# EasyEDA Pro project ProDoc_F407_2_2025-06-26.epro

# Schematic Schematic1_2
Create Date: 2025-05-06; Page Name: P1; Project Name: 主控板; Schematic Name: Schematic1_2; Update Date: 2025-05-06; Company: 嘉立创EDA; Page Size: A4; Version: V1.0
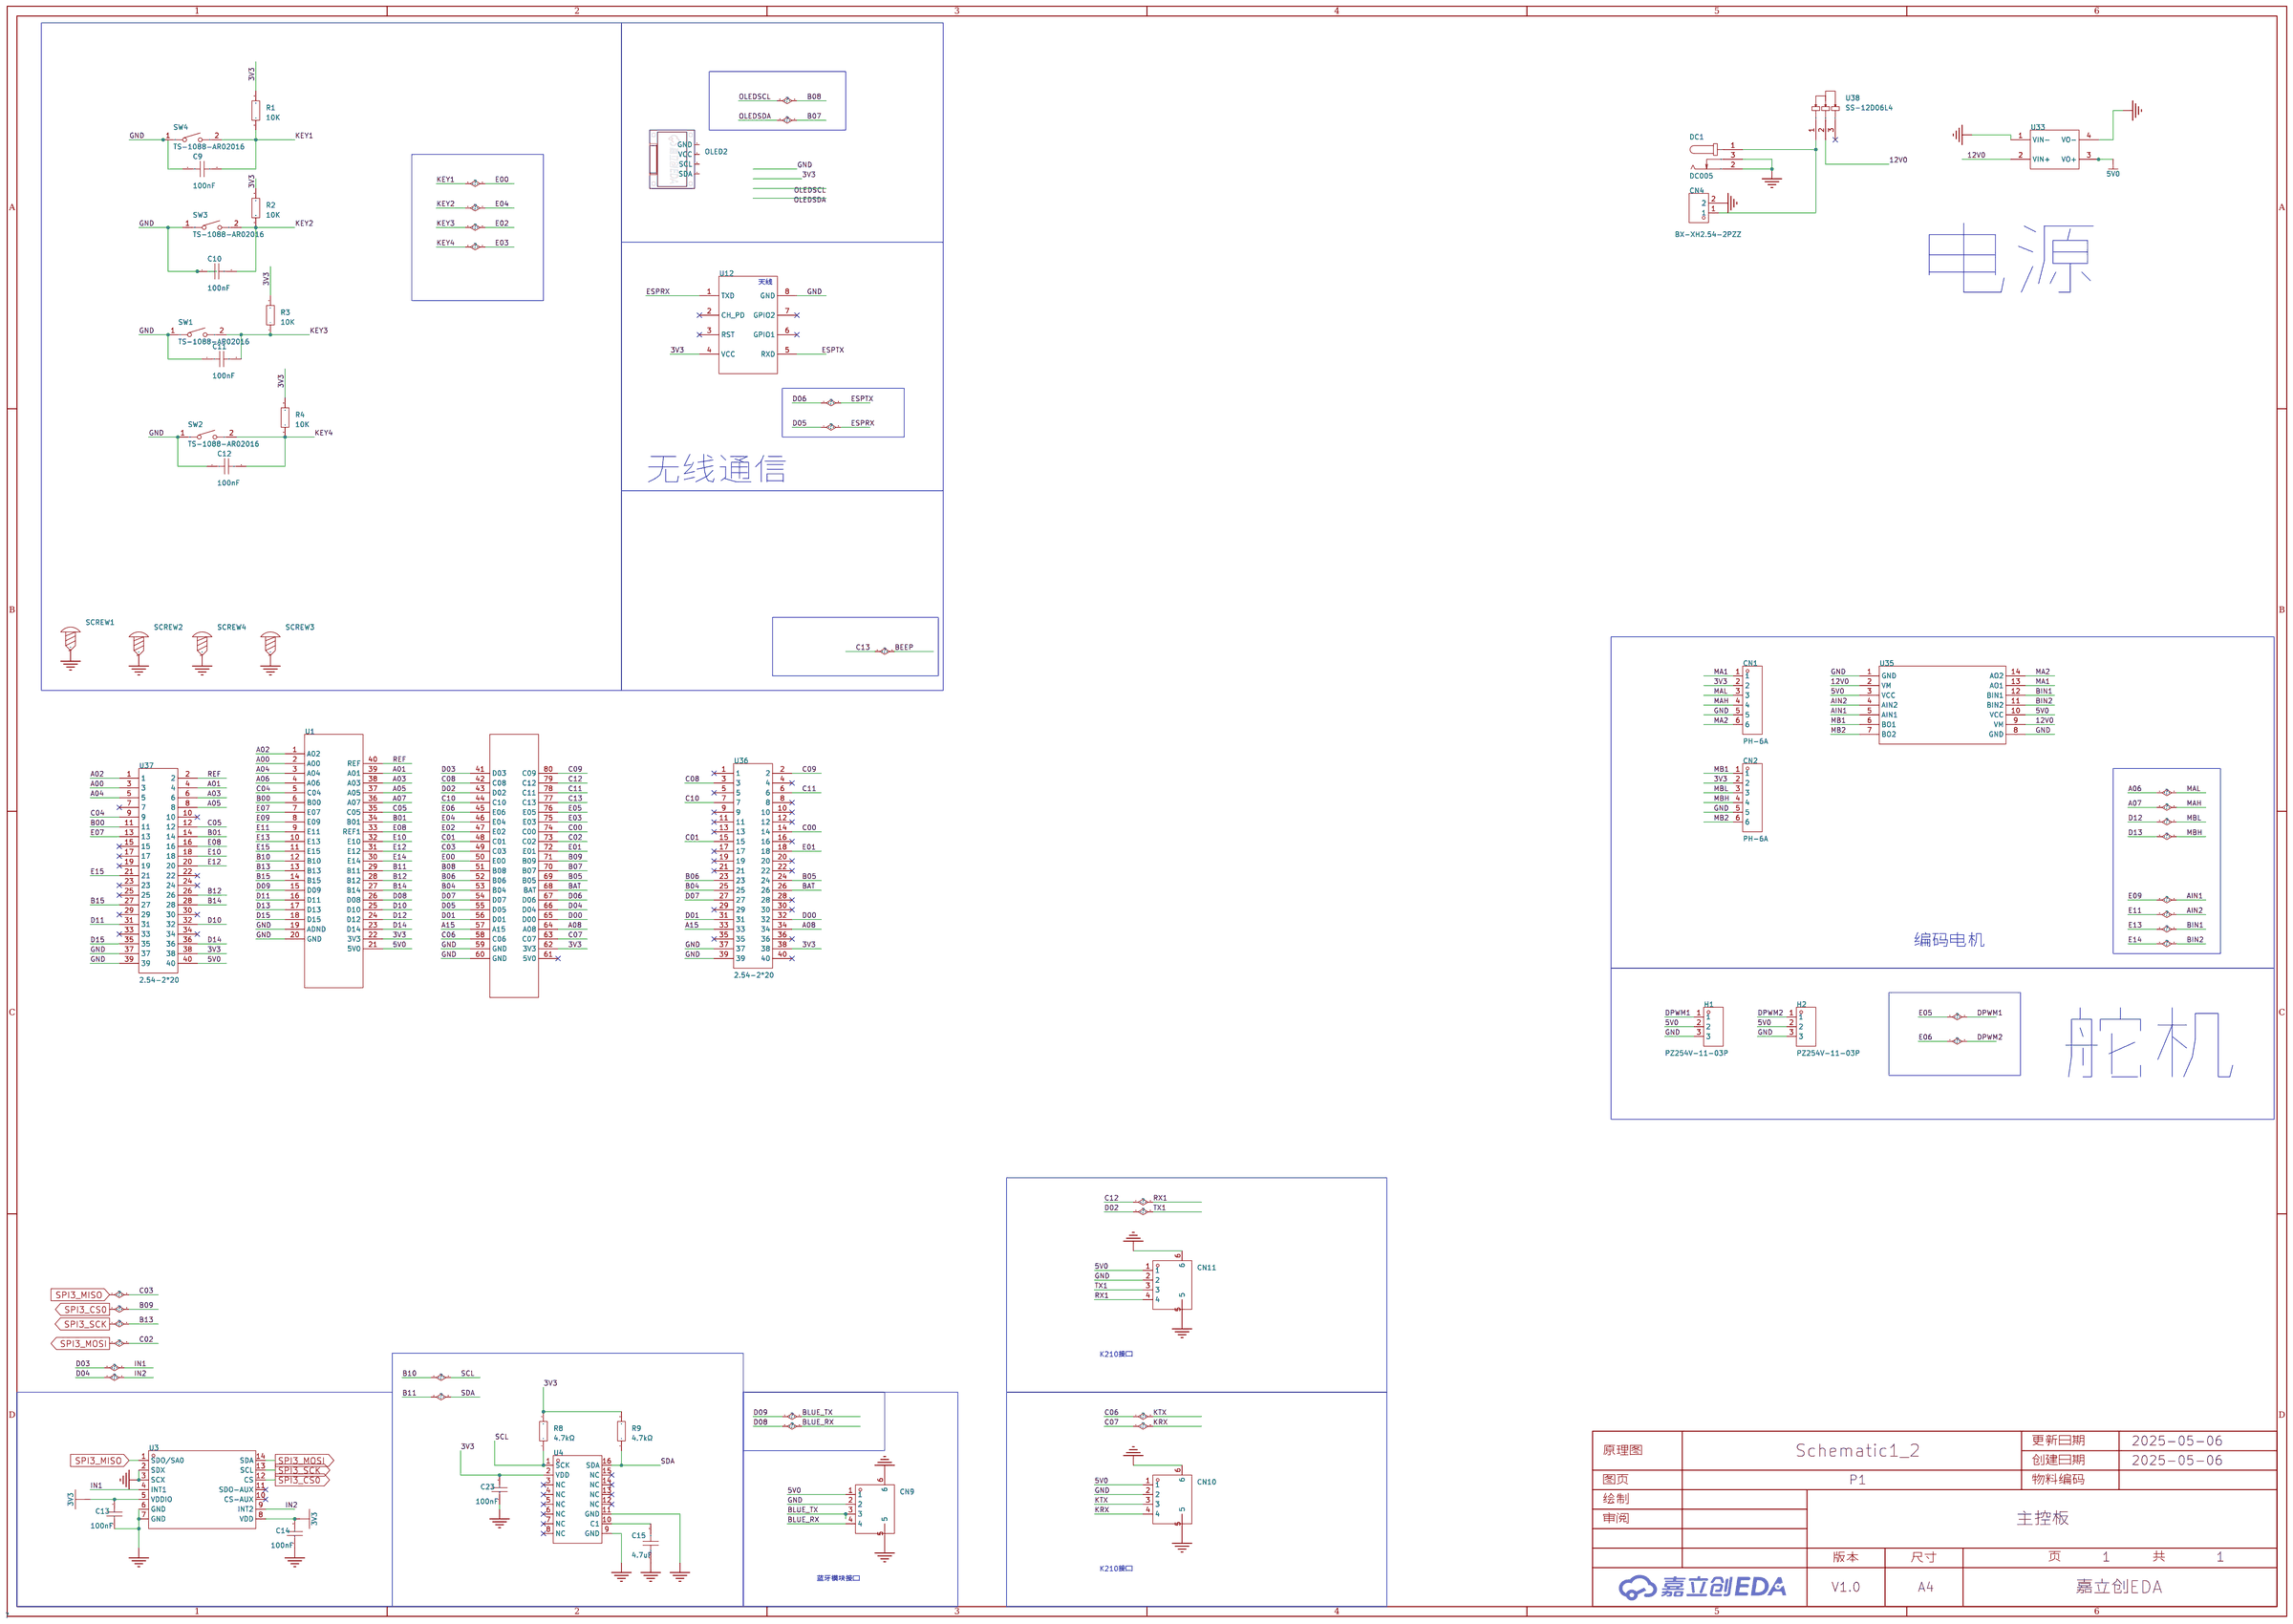
[diagram p0: schematic sheet]

## Parts
C9  100nF  [C0603]
C10  100nF  [C0603]
C11  100nF  [C0603]
C12  100nF  [C0603]
C13  100nF  [C0402]
C14  100nF  [C0402]
C15  4.7uF  [C0402]
C23  100nF  [C0402]
CN1  PH-6A  [CONN-TH_6P-P2.00_PH-6A_C2908627]
CN2  PH-6A  [CONN-TH_6P-P2.00_PH-6A_C2908627]
CN4  BX-XH2.54-2PZZ  [CONN-TH_2P-P2.50_BX-XH2.54-2PZZ]
CN9  A1257WR-S-4P  [CONN-SMD_A1257WR-S-4P]
CN10  A1257WR-S-4P  [CONN-SMD_A1257WR-S-4P]
CN11  A1257WR-S-4P  [CONN-SMD_A1257WR-S-4P]
DC1  DC005  [DC-IN-TH_DC005]
H1  PZ254V-11-03P  [HDR-TH_3P-P2.54-V-M]
H2  PZ254V-11-03P  [HDR-TH_3P-P2.54-V-M]
OLED2  -  [0.96OLED_4P]
R1  10K  [R0603]
R2  10K  [R0603]
R3  10K  [R0603]
R4  10K  [R0603]
R8  4.7kΩ  [R0402]
R9  4.7kΩ  [R0402]
SCREW1  -  [M3螺丝]
SCREW2  -  [M3螺丝]
SCREW3  -  [M3螺丝]
SCREW4  -  [M3螺丝]
SW1  TS-1088-AR02016  [SW-SMD_L3.9-W3.0-P4.45]
SW2  TS-1088-AR02016  [SW-SMD_L3.9-W3.0-P4.45]
SW3  TS-1088-AR02016  [SW-SMD_L3.9-W3.0-P4.45]
SW4  TS-1088-AR02016  [SW-SMD_L3.9-W3.0-P4.45]
U1  -  [f407]
U3  QMI8658A  [LGA-14_L3.0-W2.5-P0.50-TL]
U4  QMC5883P  [LGA-16_L3.0-W3.0-P0.50-BL_SQ]
U12  -  [ESP32-01S]
U33  -  [电源模块]
U35  -  [a4950]
U36  2.54-2*20  [HDR-TH_40P-P2.54-V-F-R2-C20-S2.54]
U37  2.54-2*20  [HDR-TH_40P-P2.54-V-F-R2-C20-S2.54]
U38  SS-12D06L4  [SW-TH_SS-12D06L4]

## Library data of the parts
C9-C12 = CAP_0603: Supplier Footprint: 0603
C13 C14 C23 = CC0402KRX7R9BB104: 容值:100nF;精度:±10%;额定电压:50V;材质(温度系数):X7R;; LCSC Part Name: 100nF ±10% 50V; Supplier Part: C131394; Manufacturer: YAGEO(国巨); Supplier Footprint: 0402; JLCPCB Part Class: Extended Part; Datasheet: https://atta.szlcsc.com/upload/public/pdf/source/20170925/C131394_1506321459057990237.pdf; Supplier: LCSC; Tolerance: ±10%; Voltage Rated: 50V; Temperature Coefficient: X7R
C15 = CC0402KRX5R6BB475: 容值:4.7uF;精度:±10%;额定电压:10V;材质(温度系数):X5R;; LCSC Part Name: 4.7uF ±10% 10V; Supplier Part: C326586; Manufacturer: YAGEO(国巨); Supplier Footprint: 0402; JLCPCB Part Class: Extended Part; Datasheet: https://atta.szlcsc.com/upload/public/pdf/source/20181031/C326586_0A24D5FB832C927D854568E36BF9A1E3.pdf; Supplier: LCSC; Tolerance: ±10%; Voltage Rated: 10V; Temperature Coefficient: X5R
CN1 CN2 = PH-6A_C2908627: 插针结构:1x6P;间距:2mm;安装方式:直插;参考系列:PH;总PIN数:6P;排数:1;每排PIN数:6;行距:-;额定电流:2A;触头材质:黄铜;触头镀层:锡;工作温度范围:-25℃~+85℃;; LCSC Part Name: 1x6P 间距:2mm 直插 系列:PH; Supplier Part: C2908627; Manufacturer: HCTL(华灿天禄); Supplier Footprint: 插件,P=2mm; JLCPCB Part Class: 扩展库; Datasheet: https://atta.szlcsc.com/upload/public/pdf/source/20230707/BA576CECAD32FECA9ECBAF2430E681CE.pdf; Supplier: LCSC; Pins Structure: 1x6P; Pitch: 2mm; Mounting Style: 直插; Reference Series: PH; Number of Pins: 6P; Number of Rows: 1; Number of PINs Per Row: 6; Current Rating (Max): 2A; Contact Material: 黄铜; Contact Plating: 锡; Operating Temperature Range: -25℃~+85℃
CN4 = BX-XH2.54-2PZZ: 插针结构:1x2P;间距:2.54mm;安装方式:直插;参考系列:XH;总PIN数:2P;排数:1;每排PIN数:2;行距:-;额定电流:3A;触头材质:黄铜;触头镀层:锡;工作温度范围:-25℃~+85℃;; LCSC Part Name: 配套胶壳型号：BX-XH2.54-2PJK 配套端子型号：BX-XH2.54-DZ 配套杜邦线型号：BX-XH2.54-2PBXC; Supplier Part: C18077833; Manufacturer: Bossie(博锡); Supplier Footprint: 插件,P=2.54mm; JLCPCB Part Class: 扩展库; Datasheet: https://atta.szlcsc.com/upload/public/pdf/source/20231017/CB25E46A13930659CD6CDE2F2553A508.pdf; Supplier: LCSC; Pins Structure: 1x2P; Pitch: 2.54mm; Mounting Style: 直插; Reference Series: XH; Number of Pins: 2P; Number of Rows: 1; Number of PINs Per Row: 2; Current Rating (Max): 3A; Contact Material: 黄铜; Contact Plating: 锡; Operating Temperature Range: -25℃~+85℃
CN9-CN11 = A1257WR-S-4P: 参考系列:GH;间距:1.25mm;插针结构:1x4P;排数:1;每排PIN数:4;行距:-;安装方式:-;触头材质:黄铜;; LCSC Part Name: GH1.25卧式贴片 镀锡 4P 针座连接器; Supplier Part: C225127; Manufacturer: CJT(长江连接器); Supplier Footprint: SMD,P=1.25mm; JLCPCB Part Class: 扩展库; Datasheet: https://atta.szlcsc.com/upload/public/pdf/source/20180509/C225127_D8D3C7F8F1F45F960D198B1E232900BE.pdf; Supplier: LCSC; Reference Series: GH; Pitch: 1.25mm; Pins Structure: 1x4P; Number of Rows: 1; Number of PINs Per Row: 4; Contact Material: 黄铜
DC1 = DC005: 连接器类型:DC电源插座;安装方式:弯插;触点内径:2mm;触点外径:6.3mm;额定电流:500mA;额定电压:30V;工作温度范围:-40℃~+55℃;; LCSC Part Name: DC电源插座 内径:2mm 外径:6.3mm; Supplier Part: C431533; Manufacturer: SHOU HAN(首韩); Supplier Footprint: 插件; JLCPCB Part Class: 扩展库; Datasheet: https://atta.szlcsc.com/upload/public/pdf/source/20190925/C431533_4751811035784AC1D38EBC85F7905E99.pdf; Supplier: LCSC; Connector Type: DC电源插座; Mounting Style: 弯插; Inside Contact Diameter: 2mm; Outside Contact Diameter: 6.3mm; Current Rating (Max): 500mA; Voltage Rating (Max): 30V; Operating Temperature Range: -40℃~+55℃
H1 H2 = PZ254V-11-03P: 插针结构:1x3P;间距:2.54mm;行距:-;圆针/方针:方针;安装类型:直插;排数:单排;总PIN位数:3P;额定电流:3A;额定电压:250V;配合针长度:6mm;塑高:2.5mm;端接针长度:3mm;工作温度范围:-40℃~+105℃;颜色:黑色;; LCSC Part Name: 间距:2.54mm 1x3P 直插 方针; Supplier Part: C2937625; Manufacturer: XFCN(兴飞); Supplier Footprint: 插件,P=2.54mm; JLCPCB Part Class: 扩展库; Datasheet: https://atta.szlcsc.com/upload/public/pdf/source/20200309/C492402_8335C3D49C4E4C618838D59BB1D024C1.pdf; Supplier: LCSC; Pin Structure: 1x3P; Pitch: 2.54mm; Circluar Pins/Square Pins: 方针; Mounting Type: 直插; Number of Rows: 单排; Number of Pins: 3P; Current Rating (Max): 3A; Voltage Rating (Max): 250V; Length of Mating Pin: 6mm; Insulation Height: 2.5mm; Length of End Connection Pin: 3mm; Operating Temperature Range: -40℃~+105℃; Color: 黑色
OLED2 = 0.96OLED模块_4P: Supplier Footprint: 插件
R1-R4 = Res_0603: Supplier Footprint: 0603
R8 R9 = 0402WGF4701TCE: 功率:1/16W;精度:±1%;阻值:4.7kΩ;温度系数:±100ppm/℃;最大工作电压:50V;工作温度范围:-55℃~+155℃;; LCSC Part Name: 4.7KΩ ±1%; Supplier Part: C25900; Manufacturer: UNI-ROYAL(厚声); Supplier Footprint: 0402; JLCPCB Part Class: Basic Part; Datasheet: https://atta.szlcsc.com/upload/public/pdf/source/20170920/C25900_1505895105102980906.pdf; Supplier: LCSC; Power(Watts): 1/16W; Tolerance: ±1%; Temperature Coefficient: ±100ppm/℃; Overload Voltage (Max): 50V; Operating Temperature Range: -55℃~+155℃
SCREW1-SCREW4 = M3螺丝: Supplier Footprint: 插件
SW1-SW4 = TS-1088-AR02016: 电路结构:单刀单掷;按钮形状:圆形按钮;作用力:160gf;安装方式:立贴;开关长度:4mm;开关宽度:3mm;开关高度:2mm;带支架:不带;触点电流:50mA;额定电压(DC):12V;绝缘电阻:100MΩ;机械寿命:10万次;; LCSC Part Name: 4*3*2mm 立贴 轻触开关; Supplier Part: C720477; Manufacturer: XUNPU(讯普); Supplier Footprint: SMD; JLCPCB Part Class: 扩展库; Datasheet: https://atta.szlcsc.com/upload/public/pdf/source/20200810/C720475_60D09DD6C54279ADDB2DC25100F1CC11.pdf; Supplier: LCSC; Circuit: 单刀单掷; Actuator Style: 圆形按钮; Operating Force: 160gf; Mounting Style: 立贴; Switch Length: 4mm; Switch Width: 3mm; Switch Height: 2mm; Strike Gundam: 不带; Contact Current: 50mA; Voltage Rating (DC): 12V; Insulation Resistance: 100MΩ; Actuator/Cap Color: 黑色; Pin Style: SMD接片; Mechanical Life: 10万次; Operating Temperature: -30℃~+80℃
U1 = f407
U3 = QMI8658A_C3021082: LCSC Part Name: 六轴陀螺仪; Supplier Part: C3021082; Manufacturer: QST(上海矽睿); Supplier Footprint: LGA-14; JLCPCB Part Class: Extended Part; Datasheet: https://atta.szlcsc.com/upload/public/pdf/source/20220606/4530BB6F29A519BF0DD0138DD1171FAE.pdf; Supplier: LCSC
U4 = QMC5883P: LCSC Part Name: 三轴磁传感器; Supplier Part: C2847467; Manufacturer: QST(上海矽睿); Supplier Footprint: LGA-16(3x3); JLCPCB Part Class: Extended Part; Datasheet: https://atta.szlcsc.com/upload/public/pdf/source/20210716/C2847467_A90ABEF37B1EC59AF528AF03CB0C7271.pdf; Supplier: LCSC
U12 = ESP32-01S
U33 = 电源模块
U35 = a4950
U36 U37 = 2.54-2*20: 插孔结构:2x20P;间距:2.54mm;行距:2.54mm;圆孔/方孔:方孔;安装类型:直插;排数:双排;总孔位数:40P;额定电流:2.5A;额定电压:-;插孔方向:顶部;塑高:8.5mm;工作温度范围:-40℃~+105℃;; LCSC Part Name: 间距:2.54mm 2x20P 直插; Supplier Part: C2977589; Manufacturer: ZHOURI(洲日); Supplier Footprint: 插件,P=2.54mm; JLCPCB Part Class: 扩展库; Datasheet: https://atta.szlcsc.com/upload/public/pdf/source/20220328/834E302BE3C038BBC5C70F5E02589B1E.pdf; Supplier: LCSC; Holes Structure: 2x20P; Pitch: 2.54mm; Row Spacing: 2.54mm; Circular Hole / Square Hole: 方孔; Mounting Type: 直插; Number of Rows: 双排; Number of Holes: 40P; Current Rating (Max): 2.5A; Holes Direction: 顶部; Insulation Height: 8.5mm; Operating Temperature Range: -40℃~+105℃
U38 = SS-12D06L4: 开关颜色:黑色;; Supplier Part: C2999734; Manufacturer: XKB Connection(中国星坤); Supplier Footprint: 插件; JLCPCB Part Class: 扩展库; Datasheet: https://atta.szlcsc.com/upload/public/pdf/source/20211009/0D67854FD60FB1F6FE75130AD47C052C.pdf; Supplier: LCSC; Actuator Color: 黑色

## Nets
3V3: C13.2 C14.2 C23.2 CN1.2 CN2.2 R1.2 R2.2 R3.2 R4.2 R8.2 R9.2 U1.22(3V3) U1.62(3V3) U3.5(VDDIO) U3.8(VDD) U4.2(VDD) U12.4(VCC) U36.38 U37.38
5V0: CN9.1 CN10.1 CN11.1 H1.2 H2.2 U1.21(5V0) U33.3(VO+) U35.3(VCC) U35.10(VCC) U37.40
12V0: U33.2(VIN+) U35.2(VM) U35.9(VM) U38.2
GND: C9.1 C10.1 C11.1 C12.1 C13.1 C14.1 C15.1 C23.1 CN1.5 CN2.5 CN4.2 CN9.2 CN9.5 CN9.6 CN10.2 CN10.5 CN10.6 CN11.2 CN11.5 CN11.6 DC1.2 DC1.3 H1.3 H2.3 SCREW1.1 SCREW2.1 SCREW3.1 SCREW4.1 SW1.1 SW2.1 SW3.1 SW4.1 U1.19(ADND) U1.20(GND) U1.59(GND) U1.60(GND) U3.2(SDX) U3.3(SCX) U3.6(GND) U3.7(GND) U4.9(GND) U4.11(GND) U12.8(GND) U33.1(VIN-) U33.4(VO-) U35.1(GND) U35.8(GND) U36.37 U36.39 U37.37 U37.39
A00: U1.2(A00) U37.3
A01: U1.39(A01) U37.4
A02: U1.1(A02) U37.1
A03: U1.38(A03) U37.6
A04: U1.3(A04) U37.5
A05: U1.37(A05) U37.8
A06: CN1.3 U1.4(A06)
A07: CN1.4 U1.36(A07)
A08: U1.64(A08) U36.34
A15: U1.57(A15) U36.33
AIN1: U1.8(E09) U35.5(AIN1)
AIN2: U1.9(E11) U35.4(AIN2)
B00: U1.6(B00) U37.11
B01: U1.34(B01) U37.14
B04: U1.53(B04) U36.25
B05: U1.69(B05) U36.24
B06: U1.52(B06) U36.23
B07: U1.70(B07)
B08: U1.51(B08)
B09: U1.71(B09) U3.12(CS)
B10: R8.1 U1.12(B10) U4.1(SCK)
B11: R9.1 U1.29(B11) U4.16(SDA)
B12: U1.28(B12) U37.26
B13: U1.13(B13) U3.13(SCL)
B14: U1.27(B14) U37.28
B15: U1.14(B15) U37.27
BAT: U1.68(BAT) U36.26
BEEP: U1.77(C13)
BIN1: U1.10(E13) U35.12(BIN1)
BIN2: U1.30(E14) U35.11(BIN2)
BLUE_RX: CN9.4 U1.26(D08)
BLUE_TX: CN9.3 U1.15(D09)
C00: U1.74(C00) U36.14
C01: U1.48(C01) U36.15
C02: U1.73(C02) U3.14(SDA)
C03: U1.49(C03) U3.1(SDO/SA0)
C04: U1.5(C04) U37.9
C05: U1.35(C05) U37.12
C06: CN10.3 U1.58(C06)
C07: CN10.4 U1.63(C07)
C08: U1.42(C08) U36.3
C09: U1.80(C09) U36.2
C10: U1.44(C10) U36.7
C11: U1.78(C11) U36.6
C12: CN11.4 U1.79(C12)
D00: U1.65(D00) U36.32
D01: U1.56(D01) U36.31
D02: CN11.3 U1.43(D02)
D03: U1.41(D03) U3.4(INT1)
D04: U1.66(D04) U3.9(INT2)
D05: U1.55(D05) U12.1(TXD)
D06: U1.67(D06) U12.5(RXD)
D07: U1.54(D07) U36.27
D10: U1.25(D10) U37.32
D11: U1.16(D11) U37.31
D12: CN2.3 U1.24(D12)
D13: CN2.4 U1.17(D13)
D14: U1.23(D14) U37.36
D15: U1.18(D15) U37.35
DPWM1: H1.1 U1.76(E05)
DPWM2: H2.1 U1.45(E06)
E00: C9.2 R1.1 SW4.2 U1.50(E00)
E01: U1.72(E01) U36.18
E02: C11.2 R3.1 SW1.2 U1.47(E02)
E03: C12.2 R4.1 SW2.2 U1.75(E03)
E04: C10.2 R2.1 SW3.2 U1.46(E04)
E07: U1.7(E07) U37.13
E08: U1.33(REF1) U37.16
E10: U1.32(E10) U37.18
E12: U1.31(E12) U37.20
E15: U1.11(E15) U37.21
MA1: CN1.1 U35.13(AO1)
MA2: CN1.6 U35.14(AO2)
MB1: CN2.1 U35.6(BO1)
MB2: CN2.6 U35.7(BO2)
REF: U1.40(REF) U37.2
$1N3134: CN4.1 DC1.1 U38.1
$1N18467: C15.2 U4.10(C1)

Not connected (* = marked no-connect by the designer): OLED2 1(GND) 2(VCC) 3(SCL) 4(SDA); U1 61(5V0)*; U3 10(CS-AUX)* 11(SDO-AUX)*; U4 3(NC)* 4(NC)* 5(NC)* 6(NC)* 7(NC)* 8(NC)* 12(NC)* 13(NC)* 14(NC)* 15(NC)*; U12 2(CH_PD)* 3(RST)* 6(GPIO1)* 7(GPIO2)*; U36 1* 4* 5* 8* 9* 10* 11* 12* 13* 16* 17* 19* 20* 21* 22* 28* 29* 30* 35* 36* 40*; U37 7* 10* 15* 17* 19* 22* 23* 24* 25* 29* 30* 33* 34*; U38 3*

## Notes on the sheet
- 天线
- 电源
- 无线通信
- 编码电机
- 舵机
- K210接口
- K210接口
- 蓝牙模块接口

# Board PCB1_2
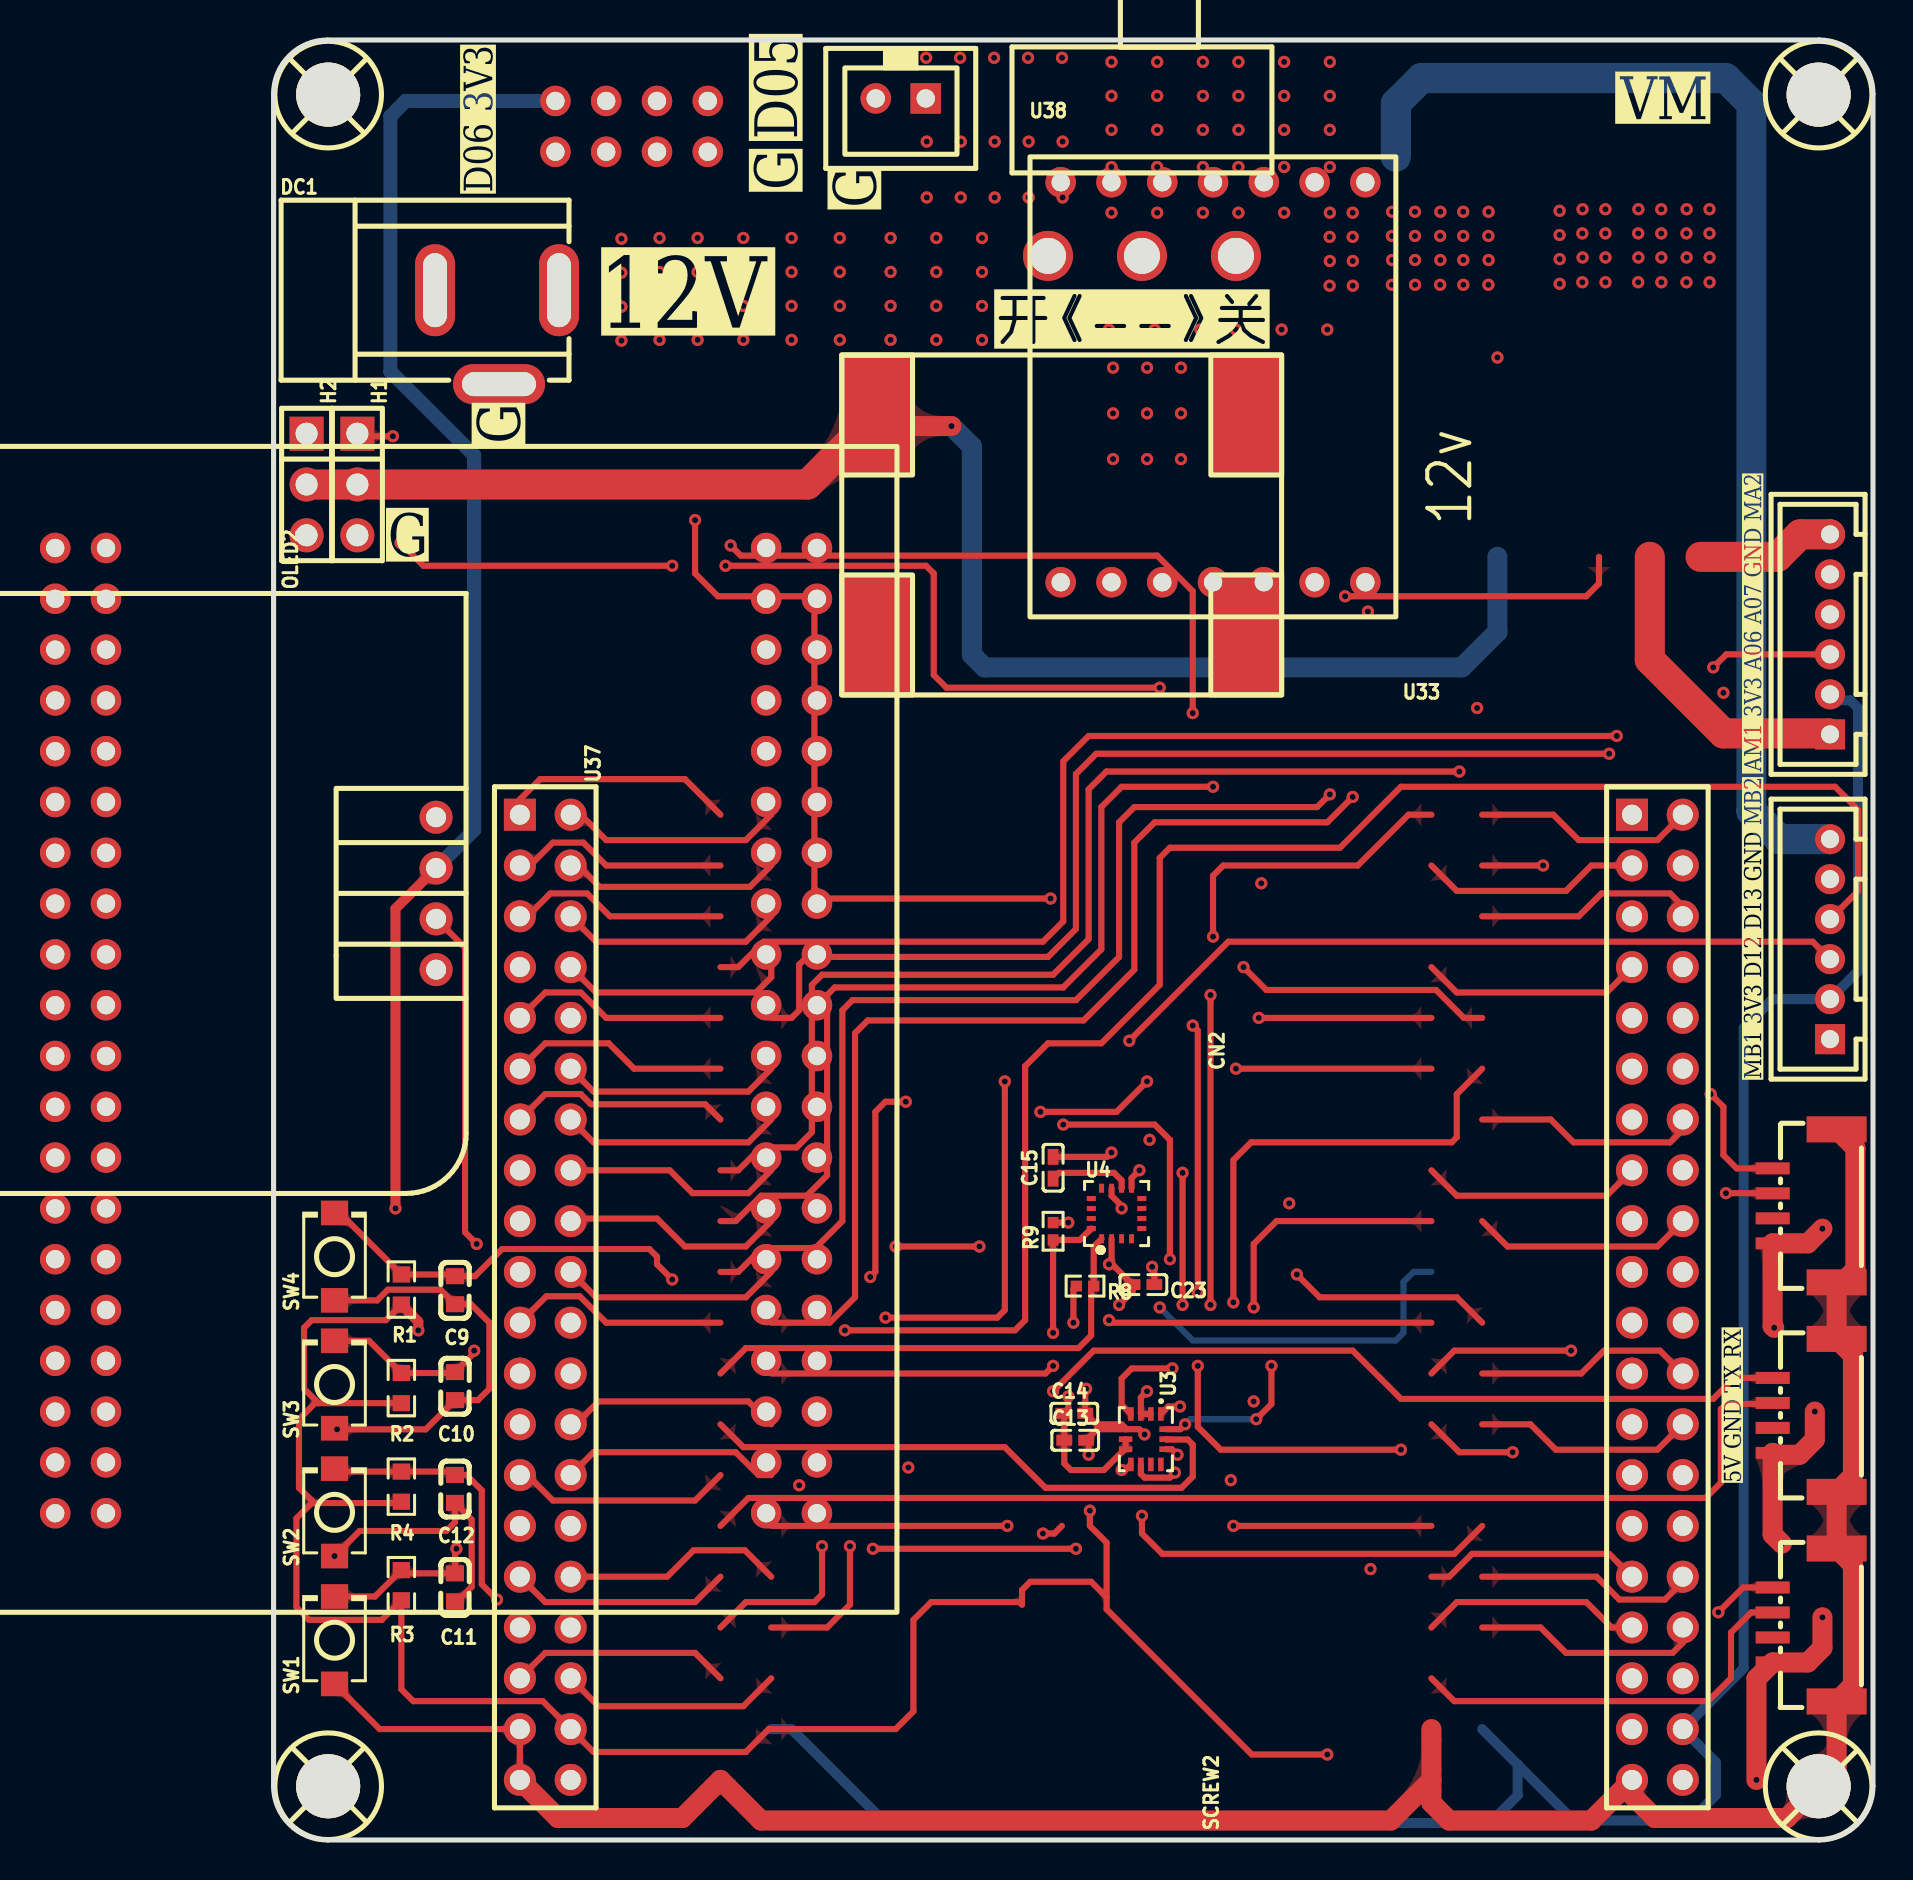
[diagram p1: board, top side]
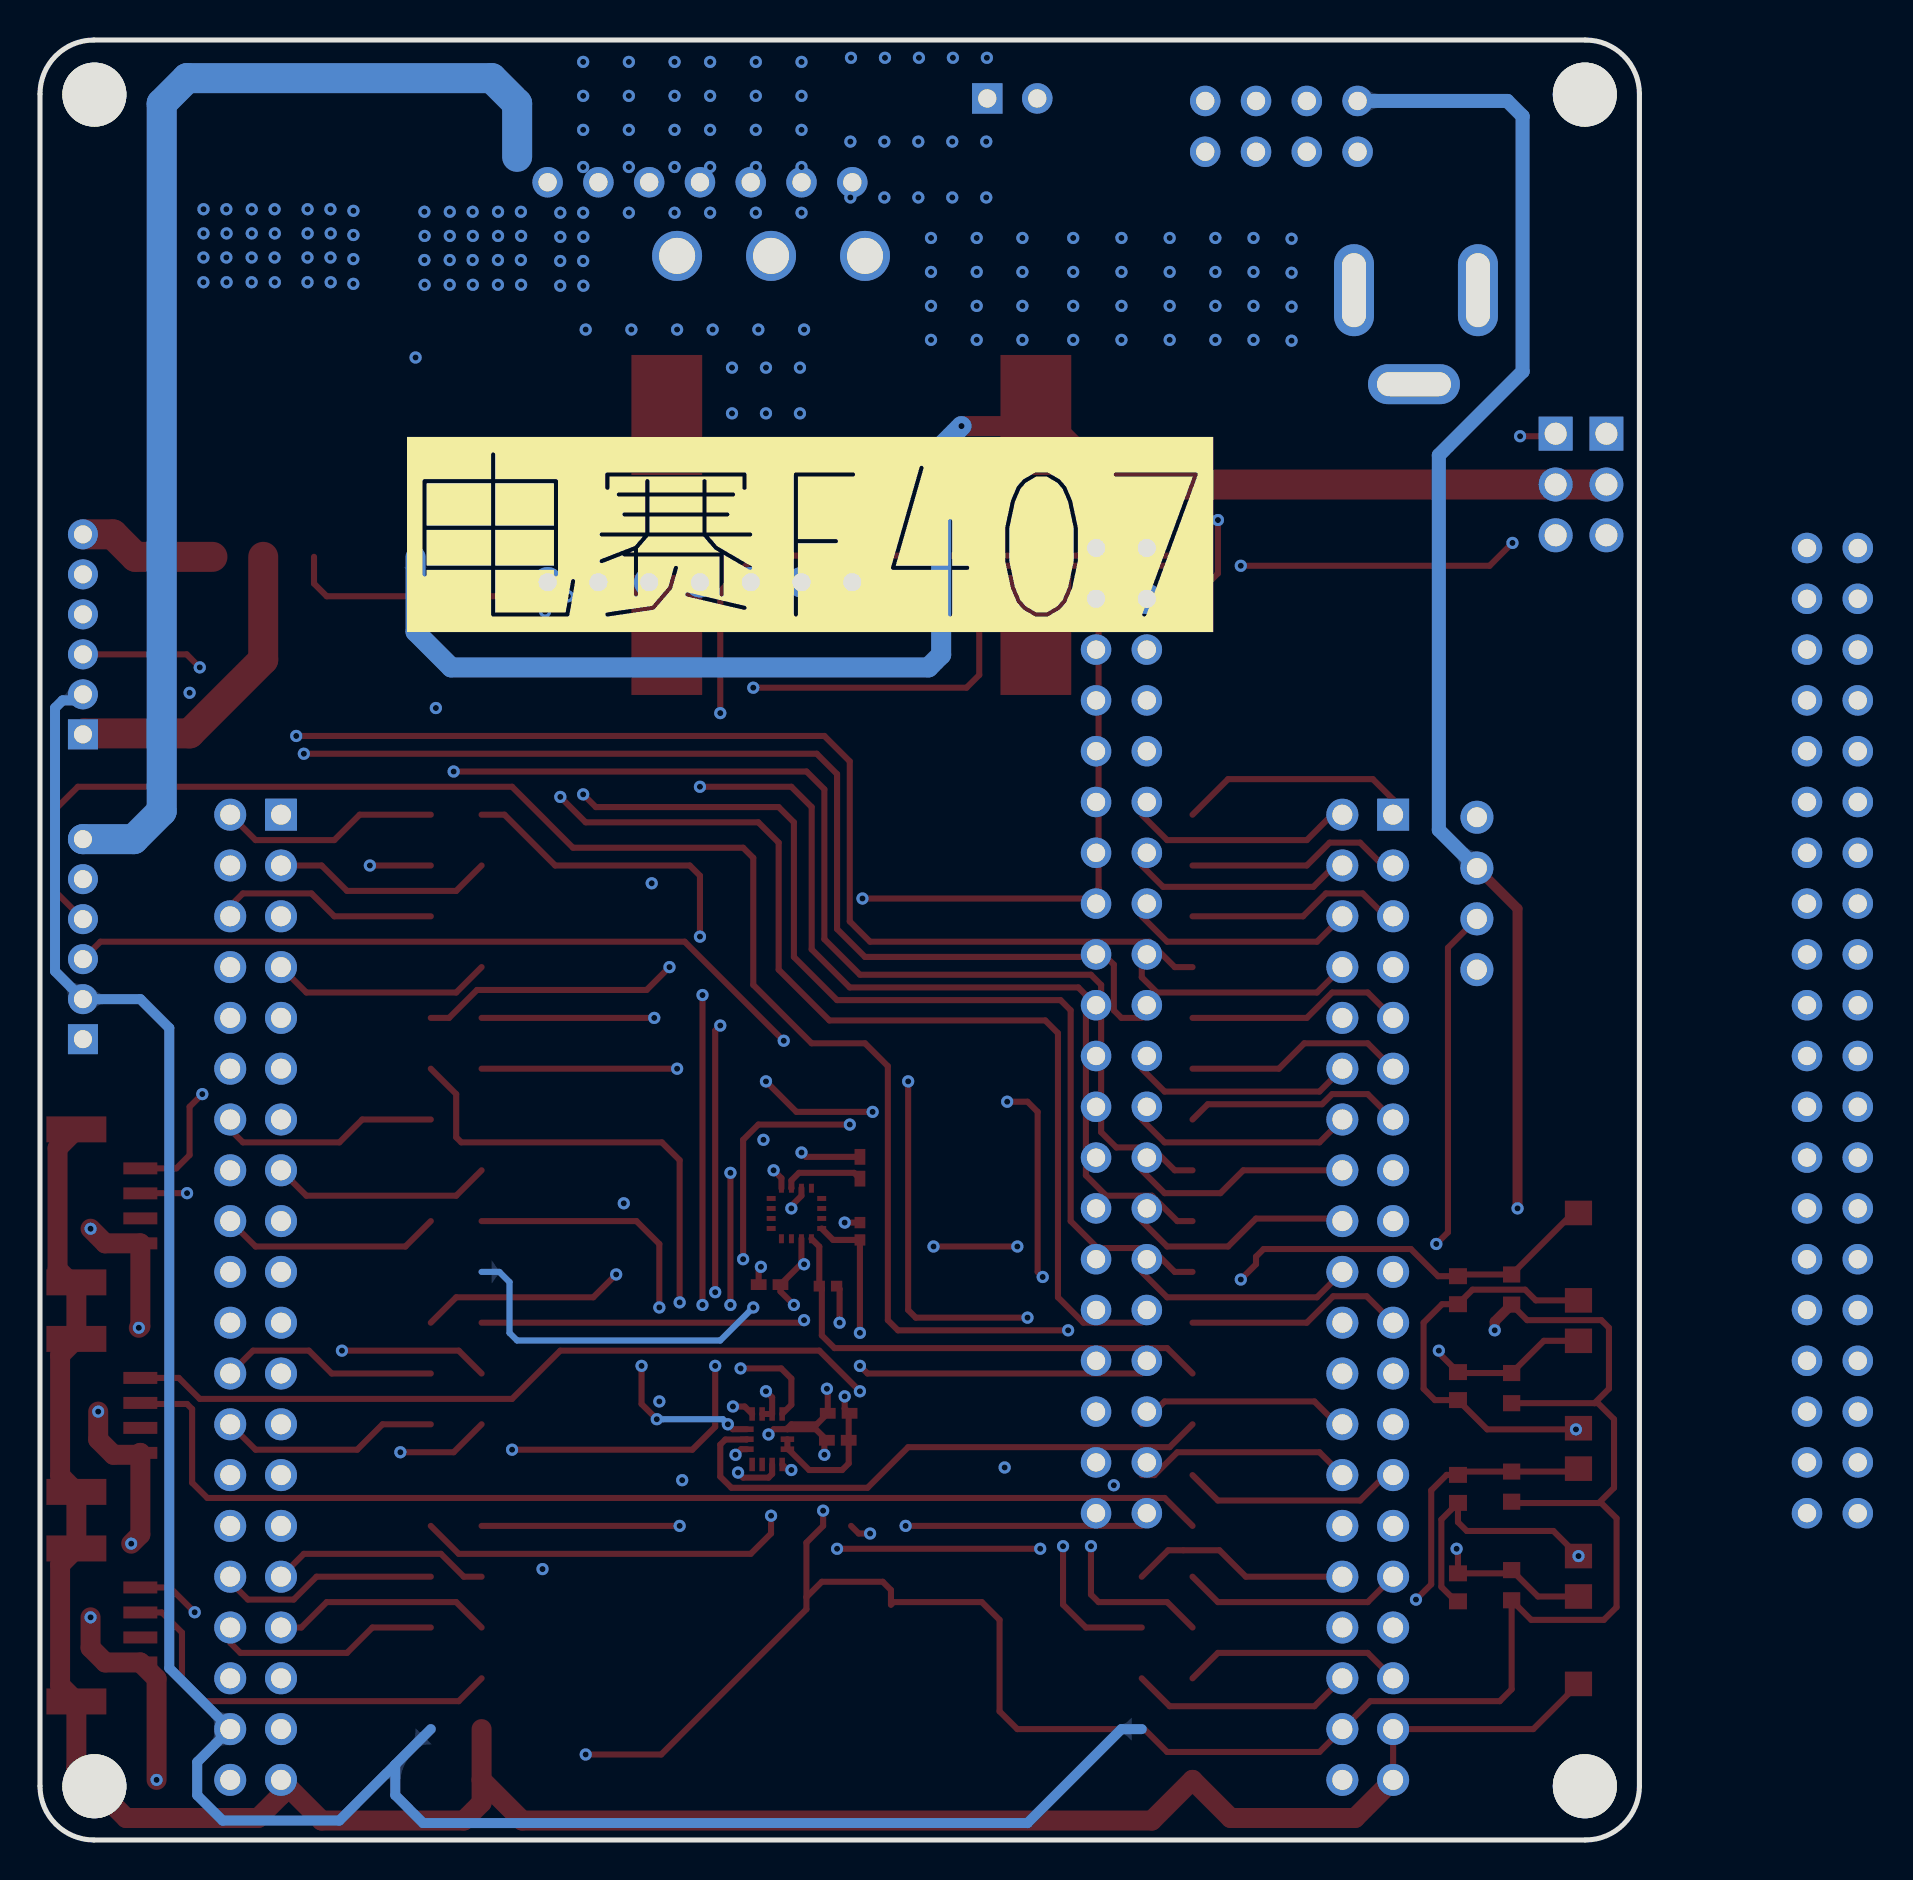
[diagram p2: board, bottom side, seen from below]

Outline 80 x 90 mm; copper layers: Top Layer, Inner1, Inner2, Bottom Layer. Coordinates in mm from the lower left corner of the outline.
Outline path: 0,87.3 0,2.7 arc(0.79,0.79) 2.7,0 77.3,0 arc(79.21,0.79) 80,2.7 80,87.3 arc(79.21,89.21) 77.3,90 2.7,90 arc(0.79,89.21) 0,87.3
Stack: Top Layer 0.035mm 外层铜厚1oz / Dielectric1 0.2104mm 7628 RC49% 8.6mil / Inner1 0.0152mm 内层铜厚 / Dielectric2 1.065mm 1.1mm H/HOZ 含铜 / Inner2 0.0152mm 内层铜厚 / Dielectric3 0.2104mm 7628 RC49% 8.6mil / Bottom Layer 0.035mm 外层铜厚1oz

## Design rules (mm)
template: JLCPCB Capability(Two Layers Board)
spacing copperThickness1oz (default): track to track 0.102, other pairs 0.152 to 0.3
spacing copperThickness2oz: track to track 0.203, other pairs 0.152 to 0.3
track width copperThickness1oz (default): min 0.127, default 0.254, max 2.54
track width copperThickness2oz: min 0.203, default 0.254, max 2.54
differential pair differentialPair (default): width min 0.127, default 0.254, max 2.54; gap min 0.152, default 0.152
via viaSize (default): diameter min 0.5, default 0.61, max 10; hole min 0.3, default 0.305, max 6.3

## Placement (name value [footprint] x y rotation side)
C9  100nF  [C0603]  9.08 27.49 90 top
C10  100nF  [C0603]  9.08 22.69 90 top
C11  100nF  [C0603]  9.08 12.63 90 top
C12  100nF  [C0603]  9.08 17.56 90 top
C13  100nF  [C0402]  40.09 19.99 0 top
C14  100nF  [C0402]  40.05 21.33 0 top
C15  4.7uF  [C0402]  38.99 33.61 270 top
C23  100nF  [C0402]  43.51 27.77 180 top
CN1  PH-6A  [CONN-TH_6P-P2.00_PH-6A_C2908627]  77.85 60.28 90 top
CN2  PH-6A  [CONN-TH_6P-P2.00_PH-6A_C2908627]  77.85 45.04 90 top
CN4  BX-XH2.54-2PZZ  [CONN-TH_2P-P2.50_BX-XH2.54-2PZZ]  31.37 87.08 180 top
CN9  A1257WR-S-4P  [CONN-SMD_A1257WR-S-4P]  76.58 21.23 90 top
CN10  A1257WR-S-4P  [CONN-SMD_A1257WR-S-4P]  76.58 10.75 90 top
CN11  A1257WR-S-4P  [CONN-SMD_A1257WR-S-4P]  76.58 31.71 90 top
DC1  DC005  [DC-IN-TH_DC005]  11.18 75.14 0 top
H1  PZ254V-11-03P  [HDR-TH_3P-P2.54-V-M]  4.19 67.78 270 top
H2  PZ254V-11-03P  [HDR-TH_3P-P2.54-V-M]  1.65 67.78 270 top
OLED2  -  [0.96OLED_4P]  8.13 47.33 270 top
R1  10K  [R0603]  6.39 27.52 270 top
R2  10K  [R0603]  6.39 22.59 270 top
R3  10K  [R0603]  6.39 12.74 270 top
R4  10K  [R0603]  6.39 17.67 270 top
R8  4.7kΩ  [R0402]  40.59 27.69 180 top
R9  4.7kΩ  [R0402]  38.99 30.44 90 top
SCREW1  -  [M3螺丝]  2.67 2.75 180 top
SCREW2  -  [M3螺丝]  77.34 2.75 90 top
SCREW3  -  [M3螺丝]  2.79 87.21 0 top
SCREW4  -  [M3螺丝]  77.34 87.21 0 top
SW1  TS-1088-AR02016  [SW-SMD_L3.9-W3.0-P4.45]  3.05 9.99 90 top
SW2  TS-1088-AR02016  [SW-SMD_L3.9-W3.0-P4.45]  3.05 16.38 90 top
SW3  TS-1088-AR02016  [SW-SMD_L3.9-W3.0-P4.45]  3.05 22.77 90 top
SW4  TS-1088-AR02016  [SW-SMD_L3.9-W3.0-P4.45]  3.05 29.17 90 top
U1  -  [f407]  22.35 51.27 0 top
U3  QMI8658A  [LGA-14_L3.0-W2.5-P0.50-TL]  43.63 20.04 270 top
U4  QMC5883P  [LGA-16_L3.0-W3.0-P0.50-BL_SQ]  42.16 31.33 0 top
U12  -  [ESP32-01S]  17.65 85.81 270 top
U33  -  [电源模块]  50.42 74.25 180 top
U35  -  [a4950]  56.13 84.16 270 top
U36  2.54-2*20  [HDR-TH_40P-P2.54-V-F-R2-C20-S2.54]  69.22 27.14 270 top
U37  2.54-2*20  [HDR-TH_40P-P2.54-V-F-R2-C20-S2.54]  13.59 27.14 270 top
U38  SS-12D06L4  [SW-TH_SS-12D06L4]  43.43 79.2 0 top

## Footprints (pads in the part's own frame, mm; a bottom-side part is the same pattern mirrored in y, then rotated)
0.96OLED_4P
  round 1.65 hole 1: 1(-3.81,-0.002) 2(-1.27,0.002) 3(1.27,0.002) 4(3.81,0.002)
a4950
  round 1.524 hole 0.914: 1(1.27,-1.524) 2(1.27,-4.064) 3(1.27,-6.604) 4(1.27,-9.144) 5(1.27,-11.684) 6(1.27,-14.224) 7(1.27,-16.764) 8(21.27,-16.764) 9(21.27,-14.224) 10(21.27,-11.684) 11(21.27,-9.144) 12(21.27,-6.604) 13(21.27,-4.064) 14(21.27,-1.524)
C0402
  rect 0.79x0.54 smd: 1(-0.545,0) 2(0.545,0)
C0603
  rect 0.8x0.9 smd: 1(-0.7,0) 2(0.7,0)
CONN-SMD_A1257WR-S-4P
  rect 0.6x1.7 smd: 1(-1.875,1.6) 2(-0.625,1.6) 3(0.625,1.6) 4(1.875,1.6)
  rect 1.3x3 smd: 5(3.825,-1.6) 6(-3.825,-1.6)
CONN-TH_2P-P2.50_BX-XH2.54-2PZZ
  rect 1.524x1.524 hole 0.914: 1(-1.25,0)
  round 1.524 hole 0.914: 2(1.25,0)
CONN-TH_6P-P2.00_PH-6A_C2908627
  rect 1.5x1.5 hole 0.9: 1(-5,0)
  round 1.5 hole 0.9: 2(-3,0) 3(-1,0) 4(1,0) 5(3,0) 6(5,0)
DC-IN-TH_DC005
  oval 2x4.6 hole 1.2x3.7: 1(3.1,2.35) 2(-3.1,2.35)
  oval 4.6x2 hole 3.7x1.2: 3(0.1,-2.35)
ESP32-01S
  round 1.524 hole 0.914: 1(-1.143,4.064) 2(-1.143,1.524) 3(-1.143,-1.016) 4(-1.143,-3.556) 5(1.397,-3.556) 6(1.397,-1.016) 7(1.397,1.524) 8(1.397,4.064)
f407
  round 1.524 hole 0.914: 1(-33.274,13.335) 2(-33.274,10.795) 3(-33.274,8.255) 4(-33.274,5.715) 5(-33.274,3.175) 6(-33.274,0.635) 7(-33.274,-1.905) 8(-33.274,-4.445) 9(-33.274,-6.985) 10(-33.274,-9.525) 11(-33.274,-12.065) 12(-33.274,-14.605) 13(-33.274,-17.145) 14(-33.274,-19.685) 15(-33.274,-22.225) 16(-33.274,-24.765) 17(-33.274,-27.305) 18(-33.274,-29.845) 19(-33.274,-32.385) 20(-33.274,-34.925) 21(-30.734,-34.925) 22(-30.734,-32.385) 23(-30.734,-29.845) 24(-30.734,-27.305) 25(-30.734,-24.765) 26(-30.734,-22.225) 27(-30.734,-19.685) 28(-30.734,-17.145) 29(-30.734,-14.605) 30(-30.734,-12.065) 31(-30.734,-9.525) 32(-30.734,-6.985) 33(-30.734,-4.445) 34(-30.734,-1.905) 35(-30.734,0.635) 36(-30.734,3.175) 37(-30.734,5.715) 38(-30.734,8.255) 39(-30.734,10.795) 40(-30.734,13.335) 41(2.286,13.335) 42(2.286,10.795) 43(2.286,8.255) 44(2.286,5.715) 45(2.286,3.175) 46(2.286,0.635) 47(2.286,-1.905) 48(2.286,-4.445) 49(2.286,-6.985) 50(2.286,-9.525) 51(2.286,-12.065) 52(2.286,-14.605) 53(2.286,-17.145) 54(2.286,-19.685) 55(2.286,-22.225) 56(2.286,-24.765) 57(2.286,-27.305) 58(2.286,-29.845) 59(2.286,-32.385) 60(2.286,-34.925) 61(4.826,-34.925) 62(4.826,-32.385) 63(4.826,-29.845) 64(4.826,-27.305) 65(4.826,-24.765) 66(4.826,-22.225) 67(4.826,-19.685) 68(4.826,-17.145) 69(4.826,-14.605) 70(4.826,-12.065) 71(4.826,-9.525) 72(4.826,-6.985) 73(4.826,-4.445) 74(4.826,-1.905) 75(4.826,0.635) 76(4.826,3.175) 77(4.826,5.715) 78(4.826,8.255) 79(4.826,10.795) 80(4.826,13.335)
HDR-TH_3P-P2.54-V-M
  rect 1.7x1.7 hole 1.1: 1(-2.54,0)
  round 1.7 hole 1.1: 2(0,0) 3(2.54,0)
HDR-TH_40P-P2.54-V-F-R2-C20-S2.54
  rect 1.6x1.6 hole 1: 1(-24.13,-1.27)
  round 1.6 hole 1: 2(-24.13,1.27) 3(-21.59,-1.27) 4(-21.59,1.27) 5(-19.05,-1.27) 6(-19.05,1.27) 7(-16.51,-1.27) 8(-16.51,1.27) 9(-13.97,-1.27) 10(-13.97,1.27) 11(-11.43,-1.27) 12(-11.43,1.27) 13(-8.89,-1.27) 14(-8.89,1.27) 15(-6.35,-1.27) 16(-6.35,1.27) 17(-3.81,-1.27) 18(-3.81,1.27) 19(-1.27,-1.27) 20(-1.27,1.27) 21(1.27,-1.27) 22(1.27,1.27) 23(3.81,-1.27) 24(3.81,1.27) 25(6.35,-1.27) 26(6.35,1.27) 27(8.89,-1.27) 28(8.89,1.27) 29(11.43,-1.27) 30(11.43,1.27) 31(13.97,-1.27) 32(13.97,1.27) 33(16.51,-1.27) 34(16.51,1.27) 35(19.05,-1.27) 36(19.05,1.27) 37(21.59,-1.27) 38(21.59,1.27) 39(24.13,-1.27) 40(24.13,1.27)
LGA-14_L3.0-W2.5-P0.50-TL
  rect 0.675x0.28 smd: 1(-1.262,0.75) 2(-1.262,0.25) 3(-1.262,-0.25) 4(-1.262,-0.75) 8(1.262,-0.75) 9(1.262,-0.25) 10(1.262,0.25) 11(1.262,0.75)
  rect 0.28x0.675 smd: 5(-0.5,-1.012) 6(0,-1.012) 7(0.5,-1.012) 12(0.5,1.012) 13(0,1.012) 14(-0.5,1.012)
LGA-16_L3.0-W3.0-P0.50-BL_SQ
  rect 0.25x0.45 smd: 1(-0.75,-1.263) 2(-0.25,-1.263) 3(0.25,-1.263) 4(0.75,-1.263) 9(0.75,1.263) 10(0.25,1.263) 11(-0.25,1.263) 12(-0.75,1.263)
  rect 0.45x0.25 smd: 5(1.263,-0.75) 6(1.263,-0.25) 7(1.263,0.25) 8(1.263,0.75) 13(-1.263,0.75) 14(-1.263,0.25) 15(-1.263,-0.25) 16(-1.263,-0.75)
M3螺丝
  round 3.2 hole 3.2: 1(-0.064,0.064)
R0402
  rect 0.566x0.54 smd: 1(-0.433,0) 2(0.433,0)
R0603
  rect 0.806x0.864 smd: 1(-0.753,0) 2(0.753,0)
SW-SMD_L3.9-W3.0-P4.45
  rect 1.23x1.36 smd: 1(-2.185,0) 2(2.185,0)
SW-TH_SS-12D06L4
  round 2.5 hole 1.8: 1(-4.7,0) 2(0,0) 3(4.7,0)
电源模块
  custom 3.54x6 smd: 1(1.77,14) 2(1.77,3) 3(20.23,3) 4(20.23,14)

## Nets
As in the schematic, except:
3V3: C13.2 C14.2 C23.2 CN1.2 CN2.2 OLED2.2 R1.2 R2.2 R3.2 R4.2 R8.2 R9.2 U1.22 U1.62 U3.5 U3.8 U4.2 U12.4 U36.38 U37.38
GND: C9.1 C10.1 C11.1 C12.1 C13.1 C14.1 C15.1 C23.1 CN1.5 CN2.5 CN4.2 CN9.2 CN9.5 CN9.6 CN10.2 CN10.5 CN10.6 CN11.2 CN11.5 CN11.6 DC1.2 DC1.3 H1.3 H2.3 OLED2.1 SCREW1.1 SCREW2.1 SCREW3.1 SCREW4.1 SW1.1 SW2.1 SW3.1 SW4.1 U1.19 U1.20 U1.59 U1.60 U3.2 U3.3 U3.6 U3.7 U4.9 U4.11 U12.8 U33.1 U33.4 U35.1 U35.8 U36.37 U36.39 U37.37 U37.39
B07: OLED2.4 U1.70
B08: OLED2.3 U1.51

Pads without a net: U1 61; U3 10 11; U4 3 4 5 6 7 8 12 13 14 15; U12 2 3 6 7; U36 1 4 5 8 9 10 11 12 13 16 17 19 20 21 22 28 29 30 35 36 40; U37 7 10 15 17 19 22 23 24 25 29 30 33 34; U38 3

## Via types
v1: diameter 0.61, hole 0.305, Top Layer to Bottom Layer, 265 vias

## Routing (per net, layer and track width the routed paths; a pad name or vN(x,y) marks a point on that pad's centre or on a via; arc(x,y) is an arc through that point)
3V3: length 334
  Top Layer w0.305: U3.5 41.19,20.54 C13.2 ; U3.5 43.3,20.54 v1(43.56,20.28) ; U3.5 42.62,20.59 42.42,20.78 41.15,20.78 C14.2 40.6,22.52 v1(40.64,22.56) ; v1(40.77,19.26) 40.77,19.9 ; 2.25,21.84 1.52,22.56 1.52,25.61 1.91,25.99 5.61,25.99 R1.2 ; 2.25,21.84 R2.2 ; 2.25,21.84 2.07,21.84 1.27,21.04 1.27,17.61 2.03,16.85 ; 41.91,30.06 41.91,28.92 v1(41.78,28.79) 41.95,28.79 C23.2 42.96,27.43 v1(42.29,26.75) ; v1(40,25.86) 40,27.54 R8.2 ; 41.66,12.14 40.89,12.91 37.85,12.91 37.44,12.5 37.44,11.77 37.31,11.9 32.89,11.9 32,11.01 32,6.43 31.12,5.54 24.76,5.54 23.62,4.4 16,4.4 13.46,6.94 6.98,6.94 6.39,7.54 R3.2 5.41,11.01 1.78,11.01 1.14,11.64 1.14,16.09 1.91,16.85 2.03,16.85 ; 41.66,12.14 41.66,11.54 48.93,4.28 v1(52.71,4.28) ; 41.66,12.14 41.66,14.87 40.83,15.71 v1(40.83,16.47) ; v1(42.42,18.5) 42.6,18.5 U3.8 ; R9.2 v1(39.75,30.87) ; 2.03,16.85 6.32,16.85 R4.2
  Top Layer w0.5: R1.2 7.24,25.92 v1(7.24,25.48) ; v1(6.1,31.58) 6.1,46.56 OLED2.2
  Inner1 w0.305: v1(40.77,19.26) 40.77,16.53 v1(40.83,16.47) ; 60.45,5.54 60.45,4.91 59.77,4.22 52.76,4.22 v1(52.71,4.28) ; v1(39.75,30.87) 40.13,30.49 40.13,29.09 40.44,28.79 v1(41.78,28.79) ; v1(40,25.86) 40.64,25.23 v1(40.64,22.56) ; v1(43.56,20.28) 43.56,19.01 43.05,18.5 v1(42.42,18.5)
  Inner1 w0.5: v1(7.24,25.48) 6.1,26.63 v1(6.1,31.58)
  Inner2 w0.305: v1(40,25.86) 40.89,26.75 v1(42.29,26.75)
  Bottom Layer w0.5: 62.23,3.77 65.02,0.97 70.87,0.97 72.14,2.24 72.14,3.89 70.49,5.54 73.53,8.59 73.53,40.6 74.98,42.04 CN2.2 79.25,43.44 79.25,56.6 78.87,56.98 78.15,56.98 CN1.2 ; 62.23,3.77 60.45,5.54 ; 62.23,3.77 62.23,2.24 60.83,0.85 30.61,0.85 25.91,5.54 24.89,5.54
  Bottom Layer w0.7: OLED2.2 10.03,50.5 10.03,69.24 5.84,73.43 5.84,86.19 6.6,86.95 14.1,86.95
5V0: length 266.8
  Top Layer w1: v1(75.06,25.61) 74.98,25.69 CN11.1 76.74,29.83 v1(77.47,30.56) ; v1(77.09,21.42) 77.09,20.02 76.33,19.26 75.07,19.26 CN9.1 74.98,15.27 v1(75.44,14.82) ; v1(33.91,70.7) 30.75,70.7 30.19,71.25 ; v1(77.47,11.13) 77.47,9.61 76.74,8.88 CN10.1 74.17,8.06 v1(74.17,3)
  Top Layer w1.5: 30.19,71.25 26.71,67.78 H1.2 H2.2
  Inner1 w1: 61.21,64.16 60.2,63.14 v1(60.2,56.6) ; v1(77.47,11.13) 77.47,12.78 v1(75.44,14.82) ; U37.40 18.16,3 19.81,1.35 24,1.35 24.89,2.24 24.89,3 48.77,3 50.67,1.1 72.26,1.1 v1(74.17,3) ; v1(77.09,21.42) 77.09,23.58 v1(75.06,25.61)
  Inner2 w1: v1(77.47,30.56) 77.47,34.37 72.26,39.58 72.26,52.28 67.45,57.09 63.61,57.09 62.61,56.09 60.71,56.09 v1(60.2,56.6) ; 66.29,84.16 66.29,85.3 66.93,85.94 74.55,85.94 75.56,84.92 75.56,70.95 74.17,69.55 61.85,69.55 61.21,68.92 61.21,64.16
  Bottom Layer w1: v1(33.91,70.7) 34.93,69.68 34.93,59.27 35.56,58.63 59.44,58.63 61.21,60.41 61.21,64.16
12V0:
  vias: v1(41.78,75.52) v1(41.91,88.91) v1(41.91,87.21) v1(41.91,85.51) v1(41.91,83.65) v1(41.91,81.36) v1(41.99,73.62) v1(41.99,71.33) v1(41.99,69.05) v1(43.69,73.62) v1(43.69,71.33) v1(43.69,69.05) v1(44.07,75.52) v1(44.2,88.91) v1(44.2,87.21) v1(44.2,85.51) v1(44.2,83.65) v1(44.2,81.36) v1(45.39,73.62) v1(45.39,71.33) v1(45.39,69.05) v1(46.35,75.52) v1(46.48,88.91) v1(46.48,87.21) v1(46.48,85.51) v1(46.48,83.65) v1(46.48,81.36) v1(48.13,75.52) v1(48.26,88.91) v1(48.26,87.21) v1(48.26,85.51) v1(48.26,83.65) v1(48.26,81.36) v1(50.42,75.52) v1(50.55,88.91) v1(50.55,87.21) v1(50.55,85.51) v1(50.55,83.65) v1(50.55,81.36) v1(52.71,75.52) v1(52.83,88.91) v1(52.83,87.21) v1(52.83,85.51) v1(52.83,83.65) v1(52.83,81.36) v1(52.82,80.16) v1(52.83,78.95) v1(52.82,77.71) v1(53.97,81.36) v1(53.97,80.16) v1(53.98,78.95) v1(53.98,77.71) v1(55.95,81.41) v1(55.94,80.2) v1(55.95,79) v1(55.94,77.76) v1(57.09,81.41) v1(57.09,80.2) v1(57.09,79) v1(57.09,77.76) v1(58.35,80.2) v1(58.35,77.76) v1(58.36,81.41) v1(58.36,79) v1(59.5,81.41) v1(59.5,80.2) v1(59.51,79) v1(59.51,77.76) v1(60.77,81.41) v1(60.76,80.2) v1(60.77,79) v1(60.76,77.76) v1(64.32,81.46) v1(64.32,80.25) v1(64.33,79.05) v1(64.33,77.81) v1(65.47,81.54) v1(65.46,80.33) v1(65.47,79.13) v1(65.46,77.89) v1(66.61,81.54) v1(66.61,80.33) v1(66.62,79.13) v1(66.62,77.89) v1(68.27,81.54) v1(68.25,80.33) v1(68.27,79.13) v1(68.25,77.89) v1(69.41,81.54) v1(69.41,80.33) v1(69.41,79.13) v1(69.41,77.89) v1(70.68,81.54) v1(70.67,80.33) v1(70.68,79.13) v1(70.67,77.89) v1(71.82,81.54) v1(71.82,80.33) v1(71.83,79.13) v1(71.83,77.89)
GND: length 173.7
  Top Layer w0.305: U3.2 U3.3 43.38,22.13 v1(43.69,22.44) ; v1(3.05,14.2) 4.3,15.45 8.64,15.45 9.08,15.89 C12.1 9.91,16.03 9.91,12.66 9.18,11.93 C11.1 ; v1(43.31,33.48) 42.91,33.09 U4.9 ; v1(38.48,15.32) 39.05,15.32 39.43,15.71 ; v1(42.42,31.58) 42.42,31.71 41.91,32.21 U4.11 ; C15.1 41.69,34.16 v1(41.91,34.37) ; v1(3.17,20.53) 7.61,20.53 C10.1 10.23,22 10.8,22.56 10.8,25.86 9.87,26.79 C9.1 8.35,27.52 5.72,27.52 5.18,26.98 SW4.1 ; U37.39 12.32,5.54 5.31,5.54 SW1.1 ; U3.6 U3.7 42.57,19.54 41.53,18.5 39.88,18.5 39.55,18.83 C13.1 39.55,21.29 C14.1 39.75,21.58 v1(39.75,22.18) ; 44.05,27.77 44.05,28.55 v1(43.94,28.66)
  Top Layer w1: CN11.6 CN9.5 78.99,24.24 78.99,18.22 CN9.6 CN10.5 78.99,13.76 78.99,7.74 CN10.6 78.18,3.59 SCREW2.1 75.69,1.1 69.09,1.1 67.94,2.24 U36.39 65.91,0.97 58.8,0.97 57.91,1.86 57.91,3 ; 57.91,3 55.88,0.97 24.38,0.97 22.35,3 20.45,1.1 14.22,1.1 U37.39 ; 57.91,3 57.91,5.54 ; CN11.5 79.12,34.59 79.12,28.53 78.49,27.9
  Bottom Layer w0.305: v1(41.91,34.37) 42.04,34.37 ; v1(43.69,22.44) 43.69,22.31
A00: length 11
  Top Layer w0.305: 12.32,48.72 12.83,48.72 13.97,49.87 15.49,49.87 16.64,48.72 22.35,48.72
A01: length 10.9
  Top Layer w0.305: 14.86,48.72 15.24,48.72 16.31,47.66 23.82,47.66 24.89,48.72
A02: length 12
  Top Layer w0.305: U37.1 12.32,52.03 13.33,53.04 20.57,53.04 22.35,51.27
A03: length 11.1
  Top Layer w0.305: 24.89,46.19 23.62,44.92 16.13,44.92 U37.6
A04: length 11
  Top Layer w0.305: U37.5 12.7,46.19 13.84,47.33 15.68,47.33 16.82,46.19 22.35,46.19
A05: length 11.4
  Top Layer w0.305: 14.86,43.64 16.13,42.38 24.13,42.38 24.89,43.14 24.89,43.64
A06: length 66.7
  Top Layer w0.305: v1(67.18,55.2) 40.77,55.2 39.5,53.93 39.5,45.93 38.48,44.92 24.51,44.92 23.24,43.64 22.35,43.64 ; CN1.3 72.66,59.28 v1(72.01,58.63)
  Inner1 w0.305: v1(72.01,58.63) 68.58,55.2 v1(67.18,55.2)
A07: length 67.2
  Top Layer w0.305: v1(66.8,54.31) 41.15,54.31 40.13,53.3 40.13,45.55 38.74,44.15 26.67,44.15 26.29,43.77 26.29,41.49 25.91,41.11 24.89,41.11
  Inner1 w0.305: v1(72.52,57.36) 69.47,54.31 v1(66.8,54.31)
  Inner2 w0.305: CN1.4 76.44,61.28 v1(72.52,57.36)
A08: length 11.5
  Top Layer w0.305: U36.34 70.49,9.86 69.98,9.35 64.64,9.35 63.37,10.62 60.45,10.62
A15: length 11.1
  Top Layer w0.305: U36.33 66.93,10.62 65.66,11.9 59.18,11.9 57.91,10.62
AIN1: length 87.2
  Top Layer w0.305: 22.35,33.48 23.24,33.48 24.38,34.63 26.16,34.63 26.92,35.39 26.92,42.76 27.43,43.26 38.99,43.26 40.77,45.04 40.77,52.53 41.66,53.42 v1(59.31,53.42)
  Inner1 w0.305: 61.21,84.16 62.48,82.89 62.48,63.2 61.47,62.19 61.47,54.31 60.58,53.42 v1(59.31,53.42)
AIN2: length 90
  Top Layer w0.305: v1(46.99,52.66) 42.42,52.66 41.4,51.65 41.4,44.53 39.5,42.63 28.07,42.63 27.69,42.25 27.69,33.23 26.67,32.22 24.38,32.22 23.11,30.94 22.35,30.94
  Inner1 w0.305: v1(61.21,74.12) 52.2,74.12 51.56,73.49 51.56,53.3 50.93,52.66 v1(46.99,52.66)
  Inner2 w0.305: v1(61.21,74.12) 62.74,74.12 63.25,74.63 63.25,83.65 63.75,84.16
B00: length 11.1
  Top Layer w0.305: U37.11 13.59,39.83 16.76,39.83 18.03,38.56 22.35,38.56
B01: length 11
  Top Layer w0.305: 24.89,36.03 23.75,34.88 16,34.88 U37.14
B04: length 11.2
  Top Layer w0.305: 57.91,20.78 59.31,19.39 v1(61.98,19.39)
  Inner1 w0.305: v1(61.98,19.39) 66.55,19.39 U36.25
B05: length 11
  Top Layer w0.305: 60.45,23.33 65.41,23.33 66.55,24.47 69.34,24.47 U36.24
B06: length 11
  Top Layer w0.305: v1(64.9,24.47) 59.06,24.47 57.91,23.33
  Inner1 w0.305: U36.23 66.8,24.47 v1(64.9,24.47)
B07: length 65.2
  Top Layer w0.305: 60.45,25.86 59.18,27.14 52.32,27.14 v1(51.18,28.28) ; v1(44.83,29.04) 44.83,35.01 44.07,35.77 v1(39.5,35.77)
  Inner1 w0.305: OLED2.4 8.13,40.72 8.89,39.96 16,39.96 16.89,39.07 16.89,38.31 18.03,37.17 25.91,37.17 27.31,35.77 v1(39.5,35.77)
  Inner2 w0.305: v1(44.83,29.04) 45.59,28.28 v1(51.18,28.28)
B08: length 66.5
  Top Layer w0.305: v1(10.16,29.8) 9.58,30.39 9.58,44.61 OLED2.3 ; 57.91,25.86 41.91,25.86 v1(41.78,25.99) ; v1(35.31,29.67) v1(31.12,29.67)
  Inner1 w0.305: v1(10.16,29.8) 10.29,29.67 v1(31.12,29.67) ; v1(35.31,29.67) 38.1,29.67 v1(41.78,25.99)
B09: length 23.6
  Top Layer w0.305: v1(45.21,19.26) 44.93,19.54 U3.12
  Inner2 w0.305: v1(45.21,19.26) 45.72,18.75 48.77,18.75 50.67,20.66 50.67,26.5 51.36,27.19 58.47,27.19 59.69,28.41 60.45,28.41
B10: length 24.4
  Top Layer w0.305: 22.35,23.33 23.62,24.59 40.26,24.59 40.89,25.23 40.89,27.57 R8.1 41.02,29.67 41.41,30.06
B11: length 22.7
  Top Layer w0.305: v1(38.99,25.36) R9.1 40.33,30 U4.16 ; 24.89,23.33 38.61,23.33 v1(38.99,23.71)
  Inner1 w0.305: v1(38.99,23.71) v1(38.99,25.36)
B12: length 11
  Top Layer w0.305: U37.26 15.11,20.78 16.26,21.93 23.75,21.93 24.89,20.78
B13: length 28.2
  Top Layer w0.305: U3.13 44.66,20.02 45.72,20.02 45.97,19.77 45.97,18.17 45.41,17.61 38.61,17.61 36.58,19.64 23.5,19.64 22.35,20.78
B14: length 11
  Top Layer w0.305: U37.28 16,19.39 23.11,19.39 24.26,18.25 24.89,18.25
B15: length 11.1
  Top Layer w0.305: U37.27 12.7,18.25 13.97,16.97 21.08,16.97 22.35,18.25
BAT: length 11.1
  Top Layer w0.305: U36.26 69.22,19.51 64.13,19.51 62.87,20.78 60.45,20.78
BEEP: length 33.7
  Inner1 w0.305: 60.45,43.64 59.18,42.38 59.18,27.39 59.06,27.26 56.9,27.26 54.86,25.23 v1(54.86,13.55)
BIN1: length 75
  Top Layer w0.305: 66.29,64.16 66.29,62.82 65.66,62.19 v1(53.59,62.19) ; v1(52.83,52.28) 52.2,51.65 43.05,51.65 42.29,50.88 42.29,44.15 40.13,41.99 28.96,41.99 28.45,41.49 28.45,30.94 27.1,29.6 24.44,29.6 23.24,28.41 22.35,28.41
  Inner1 w0.305: v1(52.83,52.28) 52.83,61.42 v1(53.59,62.19)
BIN2: length 72.3
  Top Layer w0.305: 24.89,25.86 27.81,25.86 29.08,27.14 29.08,40.34 29.72,40.98 40.51,40.98 43.05,43.52 43.05,49.87 44.07,50.88 52.71,50.88 v1(53.97,52.15)
  Inner1 w0.305: v1(53.97,52.15) 53.97,60.66 v1(54.74,61.42)
  Inner2 w0.305: 63.75,64.16 63.75,62.19 62.99,61.42 v1(54.74,61.42)
BLUE_RX: length 58.3
  Top Layer w0.305: CN9.4 73.06,23.1 72.01,22.06 56.39,22.06 53.97,24.47 41.02,24.47 v1(38.99,22.44) ; 24.89,15.71 v1(36.7,15.71)
  Inner1 w0.305: v1(38.99,22.44) 38.61,22.06 38.61,16.72 37.59,15.71 v1(36.7,15.71)
BLUE_TX: length 57.3
  Top Layer w0.305: CN9.3 74.93,21.8 72.64,21.8 72.39,21.55 72.39,17.86 71.63,17.1 23.75,17.1 22.35,15.71
C00: length 11.3
  Top Layer w0.305: 60.45,36.03 63.88,36.03 65.02,34.88 69.85,34.88 70.49,35.52 U36.14
C01: length 11.1
  Top Layer w0.305: U36.15 66.68,32.22 59.18,32.22 57.91,33.48
C02: length 26.8
  Top Layer w0.305: U3.14 45.35,20.54 v1(45.59,20.78) ; v1(49.91,23.71) 49.91,21.8 v1(49.15,21.04)
  Inner1 w0.305: v1(49.91,23.71) 49.91,30.94 v1(50.8,31.83)
  Inner2 w0.305: 60.45,33.48 60.45,32.98 59.69,32.22 51.18,32.22 v1(50.8,31.83)
  Bottom Layer w0.305: v1(45.59,20.78) 45.85,21.04 v1(49.15,21.04)
C03: length 22.1
  Top Layer w0.305: v1(45.34,21.67) 44.75,21.67 U3.1 ; 57.91,30.94 50.16,30.94 49.02,29.8 v1(49.02,26.63)
  Inner1 w0.305: v1(49.02,26.63) v1(49.02,21.93)
  Inner2 w0.305: v1(49.02,21.93) 48.77,21.67 v1(45.34,21.67)
C04: length 11.1
  Top Layer w0.305: 22.35,41.11 16.64,41.11 15.37,42.38 13.59,42.38 U37.9
C05: length 11
  Top Layer w0.305: U37.12 16,37.42 23.75,37.42 24.89,38.56
C06: length 20.7
  Top Layer w0.305: 57.91,8.09 59.06,6.94 71.75,6.94 72.9,8.09 72.9,10.37 73.9,11.38 CN10.3
C07: length 17.3
  Top Layer w0.305: v1(72.26,11.39) 73.5,12.63 CN10.4
  Inner1 w0.305: v1(72.26,11.39) 72.26,9.86 71.75,9.35 66.8,9.35 65.53,8.09 60.45,8.09
C08: length 11.1
  Top Layer w0.305: 67.94,48.72 65.91,48.72 64.64,47.45 59.18,47.45 57.91,48.72
C09: length 11.1
  Top Layer w0.305: U36.2 69.22,50 65.28,50 64.01,51.27 60.45,51.27
C10: length 11.1
  Top Layer w0.305: 57.91,43.64 59.18,42.38 66.68,42.38 67.94,43.64
C11: length 11.3
  Top Layer w0.305: U36.6 70.49,46.69 69.85,47.33 66.42,47.33 65.28,46.19 60.45,46.19
C12: length 28.1
  Top Layer w0.305: 60.45,48.72 v1(63.5,48.72) ; v1(71.88,37.3) 72.52,36.66 72.52,34.25 73.18,33.58 CN11.4
  Inner1 w0.305: v1(63.5,48.72) 64.9,48.72 65.15,48.47 65.15,38.44 66.17,37.42 71.75,37.42 v1(71.88,37.3)
D00: length 11.1
  Top Layer w0.305: 60.45,13.16 66.17,13.16 67.31,12.02 69.6,12.02 70.49,12.91 U36.32
D01: length 11
  Top Layer w0.305: U36.31 66.8,14.31 59.94,14.31 58.8,13.16 57.91,13.16
D02: length 28.9
  Top Layer w0.305: v1(72.64,32.34) 74.97,32.34 CN11.3
  Inner1 w0.305: v1(72.64,32.34) 65.91,32.34 64.13,34.12 64.13,44.53 63.75,44.92 59.18,44.92 57.91,46.19
D03: length 43.3
  Top Layer w0.305: U3.4 42.42,21.76 42.42,23.07 42.93,23.58 v1(44.96,23.58) ; 57.91,51.27 56.77,51.27 54.23,48.72 47.5,48.72 46.99,48.22 v1(46.99,45.17) ; v1(45.47,26.75) v1(45.47,33.36)
  Inner1 w0.305: v1(46.99,45.17) 46.99,43.77 48.13,42.63 48.13,40.47 45.47,37.8 v1(45.47,33.36) ; v1(45.47,26.75) 45.47,24.09 v1(44.96,23.58)
D04: length 24.9
  Top Layer w0.305: v1(43.43,16.21) 43.43,15.32 44.45,14.31 59.06,14.31 60.45,15.71 ; v1(45.09,18.37) 44.83,18.12 43.56,18.12 43.38,18.3 U3.9
  Inner2 w0.305: 45.21,18.37 45.21,16.72 44.7,16.21 v1(43.43,16.21)
D05: length 105.3
  Top Layer w0.305: v1(22.86,64.73) 23.37,64.22 44.2,64.22 45.97,62.44 v1(45.97,56.34) ; v1(46.86,26.75) v1(46.86,42.25) ; 57.91,15.71 v1(48.01,15.71)
  Inner1 w0.305: v1(46.86,26.75) 46.86,16.85 v1(48.01,15.71) ; v1(46.86,42.25) 45.97,43.14 v1(45.97,56.34) ; v1(22.86,64.73) 22.1,65.49 22.1,81.49 23.37,82.76 23.37,85.3 U12.1
D06: length 110.3
  Top Layer w0.305: v1(45.97,40.72) 46.23,40.47 v1(46.23,27.39) ; v1(38.86,47.07) 27.56,47.07 27.05,47.58 27.05,61.81 26.67,62.19 22.22,62.19 21.08,63.33 v1(21.08,66) ; v1(46.23,23.71) 46.23,20.66 47.37,19.51 v1(56.39,19.51)
  Inner1 w0.305: v1(21.08,66) 21.08,72.22 20.19,73.11 14.99,73.11 13.72,74.38 11.81,74.38 10.92,75.27 10.92,83.9 11.3,84.28 13.97,84.28 14.1,84.41 ; 60.45,18.25 59.18,19.51 v1(56.39,19.51) ; v1(45.97,40.72) 39.62,47.07 v1(38.86,47.07) ; v1(46.23,23.71) v1(46.23,27.39)
D07: length 11
  Inner1 w0.305: 57.91,18.25 59.06,17.1 66.8,17.1 U36.27
D10: length 11.1
  Top Layer w0.305: U37.32 19.69,13.16 21.01,14.49 23.57,14.49 24.89,13.16
D11: length 11.1
  Top Layer w0.305: 22.35,13.16 21.08,11.9 13.59,11.9 U37.31
D12: length 82.3
  Top Layer w0.305: 24.89,10.62 27.69,10.62 28.83,11.77 v1(28.83,14.69) ; v1(42.8,39.96) 47.75,44.92 76.98,44.92 CN2.3 ; v1(30.61,26.12) 36.19,26.12 36.58,26.5 v1(36.58,37.93)
  Inner1 w0.305: v1(30.61,26.12) 28.83,24.34 v1(28.83,14.69) ; v1(36.58,37.93) 36.58,39.07 36.96,39.45 42.29,39.45 v1(42.8,39.96)
D13: length 99.1
  Top Layer w0.305: v1(27.43,14.69) 27.43,12.28 27.05,11.9 23.62,11.9 22.35,10.62 ; CN2.4 79.25,47.44 79.25,51.52 78.1,52.66 56.39,52.66 53.34,49.61 44.83,49.61 44.32,49.11 44.32,42.76 41.4,39.83 38.74,39.83 37.59,38.69 37.59,25.99 37.08,25.48 v1(28.57,25.48)
  Inner1 w0.305: v1(28.57,25.48) 27.43,24.34 v1(27.43,14.69)
D14: length 11.2
  Top Layer w0.305: 24.89,8.09 23.5,6.69 16.26,6.69 U37.36
D15: length 11.1
  Top Layer w0.305: 22.35,8.09 21.08,9.35 13.59,9.35 U37.35
DPWM1: length 82
  Top Layer w0.305: v1(48.51,43.64) 49.66,42.5 58.14,42.5 59.54,41.11 60.45,41.11 ; v1(22.61,63.71) 32.64,63.71 33.02,63.33 33.02,58.25 33.66,57.61 v1(44.32,57.61) ; v1(6.35,64.85) 7.49,63.71 v1(19.94,63.71) ; v1(5.97,70.19) 4.32,70.19 H1.1
  Inner1 w0.305: v1(6.35,64.85) 6.35,69.81 v1(5.97,70.19) ; v1(22.61,63.71) v1(19.94,63.71)
  Inner2 w0.305: v1(44.32,57.61) 44.45,57.74 47.5,57.74 48.51,56.73 v1(48.51,43.64)
DPWM2: length 82.3
  Top Layer w0.305: 57.91,41.11 v1(49.28,41.11)
  Inner1 w0.305: v1(49.28,41.11) 48.77,41.61 48.77,42.5 49.4,43.14 v1(49.4,47.84)
  Inner2 w0.305: H2.1 2.92,69.05 20.57,69.05 24.38,65.23 33.27,65.23 33.66,64.85 33.66,58.76 34.16,58.25 48.9,58.25 49.4,57.74 v1(49.4,47.84)
E00: length 62.1
  Top Layer w0.305: v1(19.94,28.02) 19.18,28.79 19.18,29.17 18.8,29.55 11.43,29.55 10.07,28.19 C9.2 8.99,28.28 R1.1 3.31,31.35 SW4.2
  Inner2 w0.305: v1(19.94,28.02) 20.83,27.14 40,27.14 40.39,27.52 43.43,27.52 v1(44.32,26.63)
  Bottom Layer w0.305: v1(44.32,26.63) 45.97,24.98 56.13,24.98 56.51,25.36 56.51,27.9 57.02,28.41 57.91,28.41
E01: length 11.1
  Top Layer w0.305: 60.45,30.94 61.72,29.67 69.22,29.67 70.49,30.94
E02: length 73.4
  Top Layer w0.305: SW1.2 5.07,12.18 R3.1 6.55,13.33 C11.2 9.08,14.49 v1(9.14,14.56)
  Inner1 w0.305: v1(9.14,14.56) 11.56,16.97 25.53,16.97 v1(26.29,17.74) ; v1(43.81,35.01) 34.8,35.01 34.16,34.37 34.16,21.04 v1(31.75,18.63)
  Inner2 w0.305: v1(31.75,18.63) 27.18,18.63 v1(26.29,17.74) ; 57.91,36.03 56.9,35.01 v1(43.81,35.01)
E03: length 84.4
  Top Layer w0.305: v1(11.18,12.02) 10.41,12.78 10.41,17.48 9.64,18.26 C12.2 8.91,18.42 R4.1 3.19,18.42 SW2.2 ; 60.45,38.56 59.18,37.3 59.18,35.14 58.93,34.88 48.9,34.88 48.01,33.99 v1(48.01,26.88) ; v1(40.13,14.56) v1(29.97,14.56)
  Inner1 w0.305: v1(29.97,14.56) 27.43,12.02 v1(11.18,12.02) ; v1(47.88,17.99) 48.01,18.12 v1(48.01,26.88)
  Inner2 w0.305: v1(40.13,14.56) 44.45,14.56 v1(47.88,17.99)
E04: length 67.5
  Top Layer w0.305: v1(38.35,36.41) 42.16,36.41 v1(43.69,37.93) ; v1(31.62,36.91) 30.61,36.91 30.1,36.41 30.1,28.41 v1(29.84,28.15) ; SW3.2 4.78,24.96 R2.1 9.03,23.35 C10.2 10.03,24.35 v1(10.03,24.47) ; 57.91,38.56 v1(48.13,38.56)
  Inner1 w0.305: v1(38.35,36.41) 37.85,36.91 v1(31.62,36.91) ; v1(10.03,24.47) 16.13,24.47 16.64,24.98 16.64,25.86 17.91,27.14 28.83,27.14 v1(29.84,28.15)
  Inner2 w0.305: v1(48.13,38.56) 44.32,38.56 v1(43.69,37.93)
E07: length 11.1
  Top Layer w0.305: U37.13 13.59,37.3 15.37,37.3 15.88,36.79 21.59,36.79 22.35,36.03
E08: length 11
  Top Layer w0.305: 24.89,33.48 23.75,32.34 20.96,32.34 19.81,33.48 U37.16
E10: length 11.2
  Top Layer w0.305: 24.89,30.94 23.62,29.67 20.57,29.67 19.18,31.07 14.99,31.07 14.86,30.94
E12: length 11.1
  Top Layer w0.305: 24.89,28.41 23.62,27.14 16.13,27.14 U37.20
E15: length 11.1
  Top Layer w0.305: 22.35,25.86 16.64,25.86 15.32,27.19 13.64,27.19 12.32,25.86
MA1: length 15.7
  Top Layer w1.5: 68.83,64.16 68.83,59.01 72.52,55.33 77.8,55.33 CN1.1
MA2: length 6.9
  Top Layer w1.5: 71.37,64.16 75.23,64.16 76.35,65.28 CN1.6
MB1: length 68.1
  Inner1 w1.5: 58.67,84.16 58.67,86.44 59.69,87.46 72.26,87.46 73.79,85.94 73.79,40.6 74.34,40.04 CN2.1
MB2: length 61.4
  Bottom Layer w1.5: 56.13,84.16 56.13,86.83 57.4,88.09 72.64,88.09 73.91,86.83 73.91,51.44 75.31,50.04 CN2.6
REF: length 11.1
  Top Layer w0.305: 24.89,51.27 23.62,50 16.64,50 15.37,51.27 U37.2
$1N3134:
  vias: v1(17.4,80.06) v1(17.4,78.36) v1(17.4,76.67) v1(17.4,74.97) v1(19.3,80.1) v1(19.3,78.4) v1(19.3,76.7) v1(19.3,75.01) v1(21.21,80.1) v1(21.21,78.4) v1(21.21,76.7) v1(21.21,75.01) v1(23.5,80.1) v1(23.5,78.4) v1(23.5,76.7) v1(23.5,75.01) v1(25.91,80.1) v1(25.91,78.4) v1(25.91,76.7) v1(25.91,75.01) v1(28.32,80.1) v1(28.32,78.4) v1(28.32,76.7) v1(28.32,75.01) v1(30.86,80.1) v1(30.86,78.4) v1(30.86,76.7) v1(30.86,75.01) v1(32.64,89.11) v1(32.67,84.92) v1(32.67,82.13) v1(33.15,80.1) v1(33.15,78.4) v1(33.15,76.7) v1(33.15,75.01) v1(34.34,89.11) v1(34.37,84.92) v1(34.37,82.13) v1(35.43,80.1) v1(35.43,78.4) v1(35.43,76.7) v1(35.43,75.01) v1(36.04,89.11) v1(36.07,84.92) v1(36.07,82.13) v1(37.74,89.11) v1(37.77,84.92) v1(37.77,82.13) v1(39.44,89.11) v1(39.47,84.92) v1(39.47,82.13)
$1N18467: length 4.1
  Top Layer w0.305: U4.10 42.42,32.59 42.42,32.98 42.04,33.36 39.28,33.36 C15.2

## Copper pours and planes (outline as drawn; the poured copper is in the pictures)
12V0 on Top Layer: 46.88,82.76 59.94,82.76 59.94,63.2 46.88,63.2
12V0 on Top Layer: 50.9,82.76 73.05,82.76 73.05,76.28 50.9,76.28
12V0 on Top Layer: 67.66,85.81 73.15,85.81 73.15,76.28 67.66,76.28
12V0 on Top Layer: 40.84,90 54.61,90 54.61,65.36 40.84,65.36
12V0 on Bottom Layer: 49.91,82.76 70,82.76 70,76.28 49.91,76.28
12V0 on Bottom Layer: 40.96,90 54.61,90 54.61,65.36 40.96,65.36
12V0 on Bottom Layer: 46.88,82.65 59.94,82.65 59.94,63.2 46.88,63.2
GND on Top Layer: -31.75,118.45 129.16,118.45 129.16,-35.35 -31.75,-35.35
GND on Bottom Layer: -65.53,178.52 88.26,178.52 88.26,-7.16 -65.53,-7.16
GND on Inner1: -15.37,124.8 118.62,124.8 118.62,-24.3 -15.37,-24.3
GND on Inner2: -32.39,130.77 124.08,130.77 124.08,-37.51 -32.39,-37.51
$1N3134 on Top Layer: 15.43,90 33.56,90 33.56,74.25 15.43,74.25
$1N3134 on Top Layer: 10.85,80.69 40.75,80.69 40.75,74.25 10.85,74.25
$1N3134 on Top Layer: 31.31,90 40.74,90 40.74,74.25 31.31,74.25
$1N3134 on Bottom Layer: 31.2,90 40.74,90 40.74,74.25 31.2,74.25
$1N3134 on Bottom Layer: 10.92,80.69 40.74,80.69 40.74,74.25 10.92,74.25

Small or netless copper shapes (teardrops, artwork), in the pictures only: 309 on Top Layer, 15 on Bottom Layer, 98 on Inner1, 34 on Inner2

## Text on the board
Bottom Silkscreen Layer: 电赛F407
Top Silkscreen Layer: 12v | 5V GND TX RX | AM1 3V3 A06 A07 GND MA2 | MB1 3V3 D12 D13 GND MB2 | D06 3V3 | G | 开《--》关 | VM | D05 | 12V
